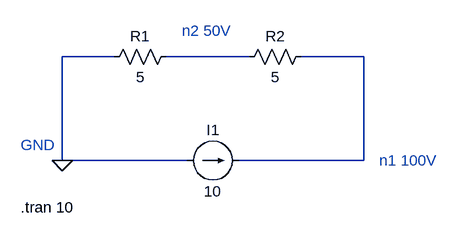
[diagram p0: schematic t4_sim.asc]
t4_sim.asc, the LTspice schematic file:
Version 4
SHEET 1 880 680
WIRE -16 112 -96 112
WIRE 192 112 64 112
WIRE 368 112 272 112
WIRE -96 272 -96 112
WIRE 96 272 -96 272
WIRE 368 272 368 112
WIRE 368 272 176 272
FLAG -96 272 0
SYMBOL current 96 272 R270
WINDOW 0 32 40 VTop 2
WINDOW 3 -32 40 VBottom 2
SYMATTR InstName I1
SYMATTR Value 10
SYMBOL res 80 96 R90
WINDOW 0 0 56 VBottom 2
WINDOW 3 32 56 VTop 2
SYMATTR InstName R1
SYMATTR Value 5
SYMBOL res 288 96 R90
WINDOW 0 0 56 VBottom 2
WINDOW 3 32 56 VTop 2
SYMATTR InstName R2
SYMATTR Value 5
TEXT -160 248 Left 2 ;GND
TEXT -160 344 Left 2 !.tran 10
TEXT 392 272 Left 2 ;n1 100V
TEXT 88 72 Left 2 ;n2 50V

The netlist it stands for:
* t4_sim.asc
I1 0 N002 10
R1 N001 0 5
R2 N002 N001 5
* GND
.tran 10
* n1 100V
* n2 50V
.backanno
.end